# Altium schematic sheet MCU.SchDoc
size A4
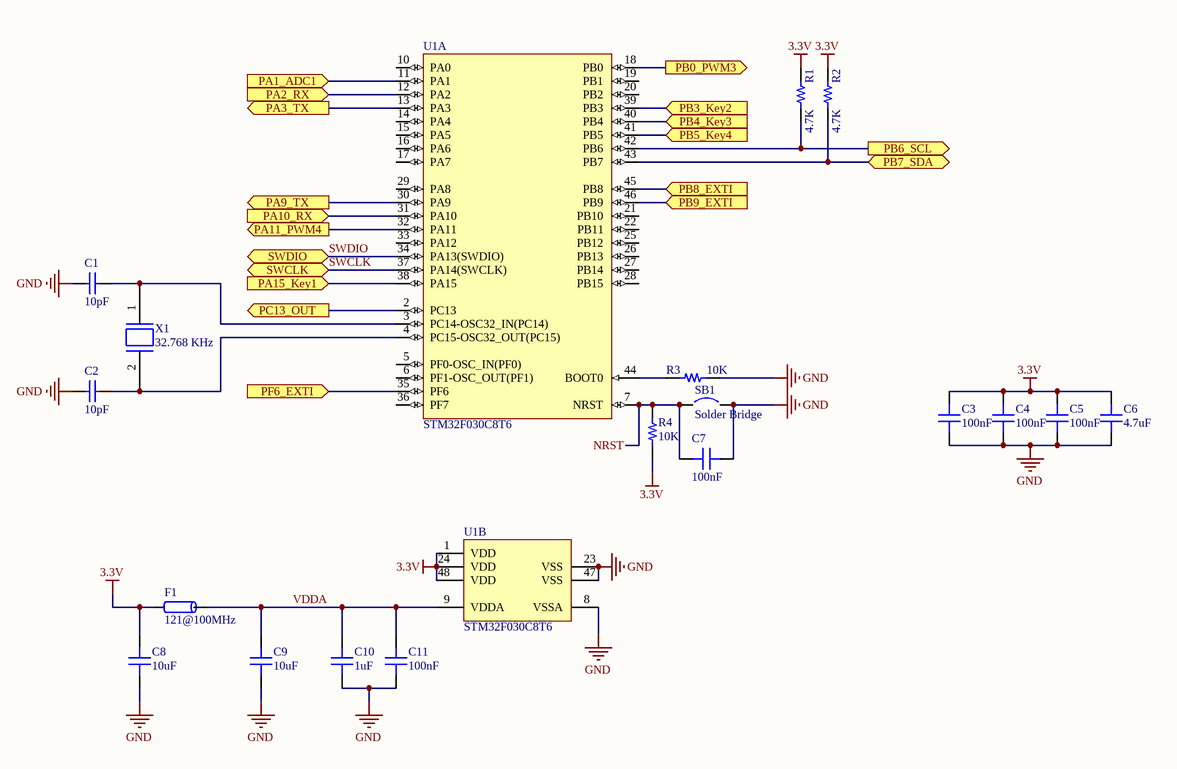
[diagram p0: MCU.SchDoc]

## Parts
C1  10pF  [0603C]
C2  10pF  [0603C]
C3  100nF  [CAP 0603_1608]
C4  100nF  [CAP 0603_1608]
C5  100nF  [CAP 0603_1608]
C6  4.7uF  [CAP 0603_1608]
C7  100nF  [CAP 0603_1608]
C8  10uF  [CAP 0603_1608]
C9  10uF  [CAP 0603_1608]
C10  1uF  [CAP 0603_1608]
C11  100nF  [CAP 0603_1608]
F1  121@100MHz  [Ferrite-0805]
R1  4.7K  [RES 0603_1608]
R2  4.7K  [RES 0603_1608]
R3  10K  [RES 0603_1608]
R4  10K  [RES 0603_1608]
SB1  Solder Bridge  [Solder Bridge]
U1  STM32F030C8T6  [LQFP-48 7x7MM P0.5MM]  (parts A,B of 2)
X1  32.768 KHz  [32.768 - Right]

## Ports
PA1_ADC1 (in), PA2_RX (in), PA3_TX (out), PA9_TX (out), PA10_RX (in), PA11_PWM4 (out), PA15_Key1 (in), PB0_PWM3 (out), PB3_Key2 (in), PB4_Key3 (in), PB5_Key4 (in), PB6_SCL (out), PB7_SDA (bidir), PB8_EXTI (in), PB9_EXTI (in), PC13_OUT (out), PF6_EXTI (in), SWCLK (bidir), SWDIO (bidir)

## Nets
3.3V: C3.2 C4.2 C5.2 C6.2 C8.2 F1.1 R1.2 R2.2 R4.1 U1.1(VDD) U1.24(VDD) U1.48(VDD)
GND: C1.1 C2.1 C3.1 C4.1 C5.1 C6.1 C7.1 C8.1 C9.1 C10.1 C11.1 R3.2 SB1.2 U1.8(VSSA) U1.23(VSS) U1.47(VSS)
NRST: C7.2 R4.2 SB1.1 U1.7(NRST)
PA1_ADC1: U1.11(PA1) ; port PA1_ADC1
PA2_RX: U1.12(PA2) ; port PA2_RX
PA3_TX: U1.13(PA3) ; port PA3_TX
PA9_TX: U1.30(PA9) ; port PA9_TX
PA10_RX: U1.31(PA10) ; port PA10_RX
PA11_PWM4: U1.32(PA11) ; port PA11_PWM4
PA15_Key1: U1.38(PA15) ; port PA15_Key1
PB0_PWM3: U1.18(PB0) ; port PB0_PWM3
PB3_Key2: U1.39(PB3) ; port PB3_Key2
PB4_Key3: U1.40(PB4) ; port PB4_Key3
PB5_Key4: U1.41(PB5) ; port PB5_Key4
PB6_SCL: R1.1 U1.42(PB6) ; port PB6_SCL
PB7_SDA: R2.1 U1.43(PB7) ; port PB7_SDA
PB8_EXTI: U1.45(PB8) ; port PB8_EXTI
PB9_EXTI: U1.46(PB9) ; port PB9_EXTI
PC13_OUT: U1.2(PC13) ; port PC13_OUT
PF6_EXTI: U1.35(PF6) ; port PF6_EXTI
SWCLK: U1.37(PA14(SWCLK)) ; port SWCLK
SWDIO: U1.34(PA13(SWDIO)) ; port SWDIO
VDDA: C9.2 C10.2 C11.2 F1.2 U1.9(VDDA)
NetC1_2: C1.2 U1.3(PC14-OSC32_IN(PC14)) X1.1
NetC2_2: C2.2 U1.4(PC15-OSC32_OUT(PC15)) X1.2
NetR3_1: R3.1 U1.44(BOOT0)

Not connected (* = marked no-connect by the designer): U1 5(PF0-OSC_IN(PF0)) 6(PF1-OSC_OUT(PF1)) 10(PA0) 14(PA4) 15(PA5) 16(PA6) 17(PA7) 19(PB1) 20(PB2) 21(PB10) 22(PB11) 25(PB12) 26(PB13) 27(PB14) 28(PB15) 29(PA8) 33(PA12) 36(PF7)

## Library data of the parts
C1 C2 = Cap: Capacitor; Value: 10pF
C3-C11 = Cap 0603: SMT Capacitor
  C3-C5 C7 C11: VALUE: 100nF
  C6: VALUE: 4.7uF
  C8 C9: VALUE: 10uF
  C10: VALUE: 1uF
F1 = Ferrite Bead
R1-R4 = Res 0603: SMT Resistor
  R1 R2: VALUE: 4.7K
  R3 R4: VALUE: 10K
U1 = STM32F030C8T6: ARM Cortex-M0 32-bit MCU, 64 KB Flash, 8 KB Internal RAM, 39 I/Os, 48-pin LQFP, -40 to 85 degC, Tray; FLASH Size (Prog) (kB): 64; I/Os (High Current): 39; Internal RAM Size (kB): 8; Operating Frequency(F) (Processor speed) (MHz): 48; Supply Voltage(Vcc) min (V): 2.4; DatasheetVersion: Rev. 1; PackageVersion: Rev. 6, 06/2013; PackageReference: LQFP48; PackageDescription: 48-Pin Low Profile Quad Flat Package, 7 x 7 mm Body, 0.5 mm Pitch; Supplier 1: Digi-Key; Supplier Part Number 1: 497-14043-ND; Supplier 2: Newark; Supplier Part Number 2: 06X3647; Supplier 3: Mouser; Supplier Part Number 3: 511-STM32F030C8T6; Core: ARM Cortex-M0; Packing: Tray; Mounting Technology: Surface Mount; PartNumber: STM32F030C8T6; ComponentLink1Description: Manufacturer URL; ComponentLink1URL: http://www.st.com/web/en/home.html; ComponentLink2Description: Datasheet; ComponentLink2URL: http://www.st.com/st-web-ui/static/active/en/resource/technical/document/datasheet/DM00088500.pdf; ComponentLink3Description: Package Specification; ComponentLink3URL: http://www.st.com/st-web-ui/static/active/en/resource/technical/document/datasheet/DM00058181.pdf
X1 = XTAL: Frequency: 32.768 KHz